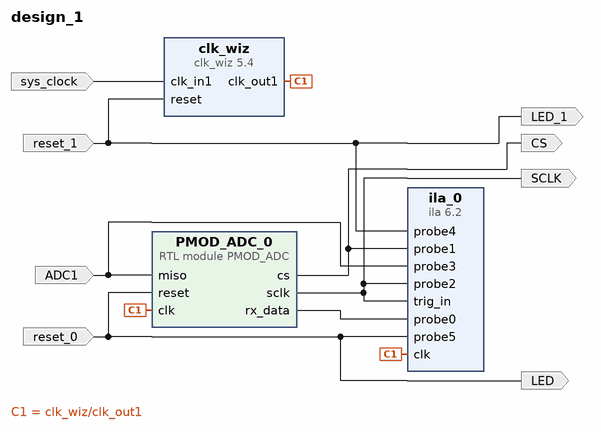
[diagram p0: block diagram of the top level]
# Vivado block design design_1, xc7z020clg484-1, Vivado 2017.4.1
create_bd_design design_1

create_bd_port -dir O CS
create_bd_port -dir I -type clk sys_clock
set_property -dict {CONFIG.FREQ_HZ 100000000 CONFIG.PHASE 0.000 CONFIG.ASSOCIATED_RESET reset_rtl} [get_bd_ports sys_clock]
create_bd_port -dir I reset_1
create_bd_port -dir O LED_1
create_bd_port -dir O SCLK
create_bd_port -dir I -type data ADC1
create_bd_port -dir I -type rst reset_0
set_property -dict {CONFIG.POLARITY ACTIVE_LOW} [get_bd_ports reset_0]
create_bd_port -dir O LED

create_bd_cell -type ip -vlnv xilinx.com:ip:ila:6.2 ila_0
set_property -dict [list \
  CONFIG.C_PROBE6_TYPE 0 \
  CONFIG.C_PROBE5_TYPE 0 \
  CONFIG.C_PROBE3_TYPE 0 \
  CONFIG.C_PROBE2_TYPE 0 \
  CONFIG.C_PROBE1_TYPE 0 \
  CONFIG.C_PROBE0_TYPE 0 \
  CONFIG.C_PROBE4_WIDTH 1 \
  CONFIG.C_PROBE3_WIDTH 1 \
  CONFIG.C_PROBE2_WIDTH 1 \
  CONFIG.C_PROBE1_WIDTH 1 \
  CONFIG.C_PROBE0_WIDTH 12 \
  CONFIG.C_DATA_DEPTH 4096 \
  CONFIG.C_NUM_OF_PROBES 6 \
  CONFIG.C_TRIGOUT_EN false \
  CONFIG.C_EN_STRG_QUAL 1 \
  CONFIG.C_INPUT_PIPE_STAGES 0 \
  CONFIG.C_ADV_TRIGGER false \
  CONFIG.C_PROBE7_MU_CNT 2 \
  CONFIG.C_PROBE6_MU_CNT 3 \
  CONFIG.C_PROBE5_MU_CNT 3 \
  CONFIG.C_PROBE4_MU_CNT 3 \
  CONFIG.C_PROBE3_MU_CNT 3 \
  CONFIG.C_PROBE2_MU_CNT 3 \
  CONFIG.C_PROBE1_MU_CNT 3 \
  CONFIG.C_PROBE0_MU_CNT 3 \
  CONFIG.C_TRIGIN_EN true \
  CONFIG.ALL_PROBE_SAME_MU true \
  CONFIG.ALL_PROBE_SAME_MU_CNT 3 \
  CONFIG.C_ENABLE_ILA_AXI_MON false \
  CONFIG.C_MONITOR_TYPE Native \
] [get_bd_cells ila_0]
create_bd_cell -type ip -vlnv xilinx.com:ip:clk_wiz:5.4 clk_wiz
set_property -dict [list \
  CONFIG.CLKOUT2_USED false \
  CONFIG.NUM_OUT_CLKS 1 \
  CONFIG.CLKOUT2_REQUESTED_OUT_FREQ 5 \
  CONFIG.MMCM_DIVCLK_DIVIDE 1 \
  CONFIG.MMCM_CLKFBOUT_MULT_F 10.000 \
  CONFIG.MMCM_CLKOUT0_DIVIDE_F 10.000 \
  CONFIG.MMCM_CLKOUT1_DIVIDE 1 \
  CONFIG.USE_BOARD_FLOW true \
  CONFIG.CLK_IN1_BOARD_INTERFACE sys_clock \
  CONFIG.CLKOUT1_JITTER 130.958 \
  CONFIG.CLKOUT1_PHASE_ERROR 98.575 \
  CONFIG.CLKOUT2_JITTER 270.159 \
  CONFIG.CLKOUT2_PHASE_ERROR 128.132 \
] [get_bd_cells clk_wiz]
create_bd_cell -type module -reference PMOD_ADC PMOD_ADC_0

# ---- connections ----

connect_bd_net -net PMODAD1_Driver_0_Chip_sel [get_bd_pins PMOD_ADC_0/cs] [get_bd_ports CS] [get_bd_pins ila_0/probe1]
connect_bd_net [get_bd_ports sys_clock] [get_bd_pins clk_wiz/clk_in1]
connect_bd_net -net reset_1_1 [get_bd_ports reset_1] [get_bd_ports LED_1] [get_bd_pins clk_wiz/reset] [get_bd_pins ila_0/probe4]
connect_bd_net -net PMODAD1_Driver_0_sclk [get_bd_pins PMOD_ADC_0/sclk] [get_bd_ports SCLK] [get_bd_pins ila_0/probe2] [get_bd_pins ila_0/trig_in]
connect_bd_net -net ADC1_1 [get_bd_ports ADC1] [get_bd_pins ila_0/probe3] [get_bd_pins PMOD_ADC_0/miso]
connect_bd_net -net reset_0_1 [get_bd_ports reset_0] [get_bd_ports LED] [get_bd_pins ila_0/probe5] [get_bd_pins PMOD_ADC_0/reset]
connect_bd_net [get_bd_pins clk_wiz/clk_out1] [get_bd_pins PMOD_ADC_0/clk] [get_bd_pins ila_0/clk]
connect_bd_net [get_bd_pins PMOD_ADC_0/rx_data] [get_bd_pins ila_0/probe0]

validate_bd_design
save_bd_design
